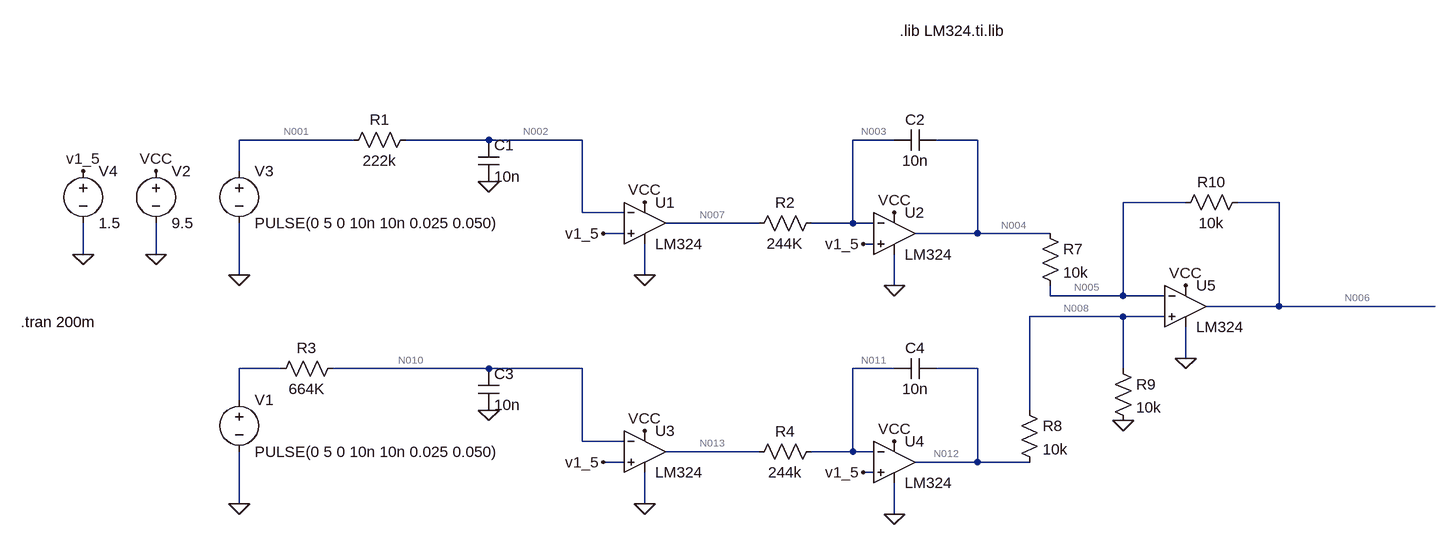
[diagram p0: schematic Draft1.asc]
Draft1.asc, the LTspice schematic file:
Version 4
SHEET 1 1124 740
WIRE -544 112 -720 112
WIRE -336 112 -464 112
WIRE -192 112 -336 112
WIRE 288 112 224 112
WIRE 416 112 352 112
WIRE -336 128 -336 112
WIRE -720 160 -720 112
WIRE 736 208 640 208
WIRE 880 208 816 208
WIRE -192 224 -192 112
WIRE -128 224 -192 224
WIRE 80 240 -64 240
WIRE 224 240 224 112
WIRE 224 240 160 240
WIRE 256 240 224 240
WIRE -128 256 -160 256
WIRE 416 256 416 112
WIRE 416 256 320 256
WIRE 528 256 416 256
WIRE 256 272 240 272
WIRE -960 288 -960 240
WIRE -848 288 -848 240
WIRE -720 320 -720 240
WIRE -96 320 -96 272
WIRE 288 336 288 288
WIRE 528 352 528 336
WIRE 640 352 640 208
WIRE 640 352 528 352
WIRE 704 352 640 352
WIRE 880 368 880 208
WIRE 880 368 768 368
WIRE 1120 368 880 368
WIRE 640 384 496 384
WIRE 704 384 640 384
WIRE 736 448 736 400
WIRE -656 464 -720 464
WIRE -336 464 -576 464
WIRE -192 464 -336 464
WIRE 288 464 224 464
WIRE 416 464 352 464
WIRE 640 464 640 384
WIRE -336 480 -336 464
WIRE -720 512 -720 464
WIRE 496 528 496 384
WIRE -192 576 -192 464
WIRE -128 576 -192 576
WIRE 80 592 -64 592
WIRE 224 592 224 464
WIRE 224 592 160 592
WIRE 256 592 224 592
WIRE -128 608 -160 608
WIRE 416 608 416 464
WIRE 416 608 320 608
WIRE 496 608 416 608
WIRE 256 624 240 624
WIRE -720 672 -720 592
WIRE -96 672 -96 624
WIRE 288 688 288 640
FLAG -848 288 0
FLAG -848 160 VCC
FLAG -720 672 0
FLAG -336 176 0
FLAG -960 288 0
FLAG -960 160 v1_5
FLAG -96 208 VCC
FLAG -96 320 0
FLAG -160 256 v1_5
FLAG 288 224 VCC
FLAG 288 336 0
FLAG 240 272 v1_5
FLAG -336 528 0
FLAG -96 560 VCC
FLAG -96 672 0
FLAG -160 608 v1_5
FLAG 288 576 VCC
FLAG 288 688 0
FLAG 240 624 v1_5
FLAG 736 336 VCC
FLAG 736 448 0
FLAG 640 544 0
FLAG -720 320 0
SYMBOL voltage -848 144 R0
WINDOW 123 0 0 Left 0
WINDOW 39 0 0 Left 0
SYMATTR InstName V2
SYMATTR Value 9.5
SYMBOL voltage -720 496 R0
WINDOW 123 0 0 Left 0
WINDOW 39 0 0 Left 0
SYMATTR InstName V1
SYMATTR Value PULSE(0 5 0 10n 10n 0.025 0.050)
SYMBOL cap -352 112 R0
SYMATTR InstName C1
SYMATTR Value 10n
SYMBOL OpAmps\\opamp2 -96 176 R0
SYMATTR InstName U1
SYMATTR Value LM324
SYMBOL voltage -960 144 R0
SYMATTR InstName V4
SYMATTR Value 1.5
SYMBOL OpAmps\\opamp2 288 192 R0
SYMATTR InstName U2
SYMATTR Value LM324
SYMBOL cap 352 96 R90
WINDOW 0 0 32 VBottom 2
WINDOW 3 32 32 VTop 2
SYMATTR InstName C2
SYMATTR Value 10n
SYMBOL cap -352 464 R0
SYMATTR InstName C3
SYMATTR Value 10n
SYMBOL OpAmps\\opamp2 -96 528 R0
SYMATTR InstName U3
SYMATTR Value LM324
SYMBOL OpAmps\\opamp2 288 544 R0
SYMATTR InstName U4
SYMATTR Value LM324
SYMBOL cap 352 448 R90
WINDOW 0 0 32 VBottom 2
WINDOW 3 32 32 VTop 2
SYMATTR InstName C4
SYMATTR Value 10n
SYMBOL OpAmps\\opamp2 736 304 R0
SYMATTR InstName U5
SYMATTR Value LM324
SYMBOL res 512 240 R0
SYMATTR InstName R7
SYMATTR Value 10k
SYMBOL res 480 512 R0
SYMATTR InstName R8
SYMATTR Value 10k
SYMBOL res 624 448 R0
SYMATTR InstName R9
SYMATTR Value 10k
SYMBOL res 832 192 R90
WINDOW 0 0 56 VBottom 2
WINDOW 3 32 56 VTop 2
SYMATTR InstName R10
SYMATTR Value 10k
SYMBOL res -448 96 R90
WINDOW 0 0 56 VBottom 2
WINDOW 3 32 56 VTop 2
SYMATTR InstName R1
SYMATTR Value 222k
SYMBOL res -560 448 R90
WINDOW 0 0 56 VBottom 2
WINDOW 3 32 56 VTop 2
SYMATTR InstName R3
SYMATTR Value 664K
SYMBOL voltage -720 144 R0
WINDOW 123 0 0 Left 0
WINDOW 39 0 0 Left 0
SYMATTR InstName V3
SYMATTR Value PULSE(0 5 0 10n 10n 0.025 0.050)
SYMBOL res 176 224 R90
WINDOW 0 0 56 VBottom 2
WINDOW 3 32 56 VTop 2
SYMATTR InstName R2
SYMATTR Value 244K
SYMBOL res 176 576 R90
WINDOW 0 0 56 VBottom 2
WINDOW 3 32 56 VTop 2
SYMATTR InstName R4
SYMATTR Value 244k
TEXT 296 -56 Left 2 !.lib LM324.ti.lib
TEXT -1056 392 Left 2 !.tran 200m

The netlist it stands for:
* Draft1.asc
V2 VCC 0 9.5
V1 N009 0 PULSE(0 5 0 10n 10n 0.025 0.050)
C1 N002 0 10n
XU1 v1_5 N002 VCC 0 N007 LM324  ; pins In+ In- V+ V- OUT
V4 v1_5 0 1.5
XU2 v1_5 N003 VCC 0 N004 LM324  ; pins In+ In- V+ V- OUT
C2 N004 N003 10n
C3 N010 0 10n
XU3 v1_5 N010 VCC 0 N013 LM324  ; pins In+ In- V+ V- OUT
XU4 v1_5 N011 VCC 0 N012 LM324  ; pins In+ In- V+ V- OUT
C4 N012 N011 10n
XU5 N008 N005 VCC 0 N006 LM324  ; pins In+ In- V+ V- OUT
R7 N004 N005 10k
R8 N008 N012 10k
R9 N008 0 10k
R10 N006 N005 10k
R1 N002 N001 222k
R3 N010 N009 664K
V3 N001 0 PULSE(0 5 0 10n 10n 0.025 0.050)
R2 N003 N007 244K
R4 N011 N013 244k
.lib LM324.ti.lib
.tran 200m
.backanno
.end

* Results of the author's LTspice run, read from the files saved beside the schematic
* Operating Point, zero values left out:
*   V(vcc) = 9.5 V
*   V(n002) = 9.063 mV
*   V(n007) = 7.996 V
*   V(v1_5) = 1.5 V
*   V(n004) = 4.304 mV
*   V(n003) = 7.996 V
*   V(n010) = 27.1 mV
*   V(n013) = 7.996 V
*   V(n012) = 4.304 mV
*   V(n011) = 7.996 V
*   V(n006) = 40.45 mV
*   V(n005) = 22.45 mV
*   V(n008) = 2.28 mV
*   I(R4) = -13.86 pA
*   I(R2) = -13.86 pA
*   I(R3) = 40.82 nA
*   I(R1) = 40.82 nA
*   I(R10) = 1.799 µA
*   I(R9) = 228 nA
*   I(R8) = -202.5 nA
*   I(R7) = -1.815 µA
*   I(V3) = 40.82 nA
*   I(V4) = 81.04 nA
*   I(V1) = 40.82 nA
*   I(V2) = -1.601 mA
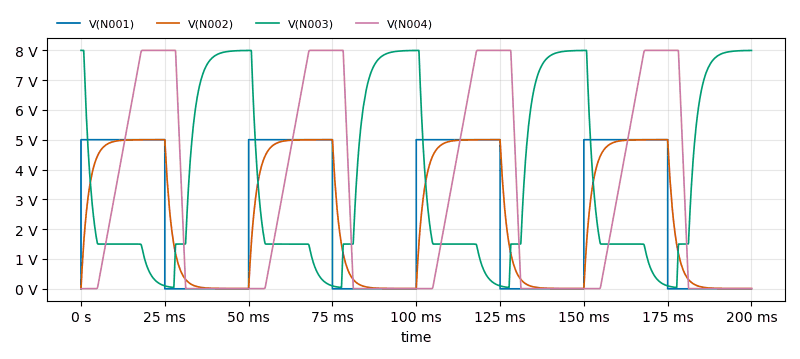
[diagram p1: Transient Analysis of Draft1.asc, plotted from the saved traces]
* Transient Analysis, 1 run:
*   V(N001): min 0 V, max 5 V, average 2.5 V, rms 3.536 V, last 0 V
*   V(N002): min 9.063 mV, max 5 V, average 2.505 V, rms 3.377 V, last 9.126 mV
*   V(N003): min 43.34 mV, max 7.996 V, average 3.7 V, rms 4.83 V, last 7.993 V
*   V(N004): min 4.301 mV, max 7.996 V, average 2.924 V, rms 4.468 V, last 4.304 mV